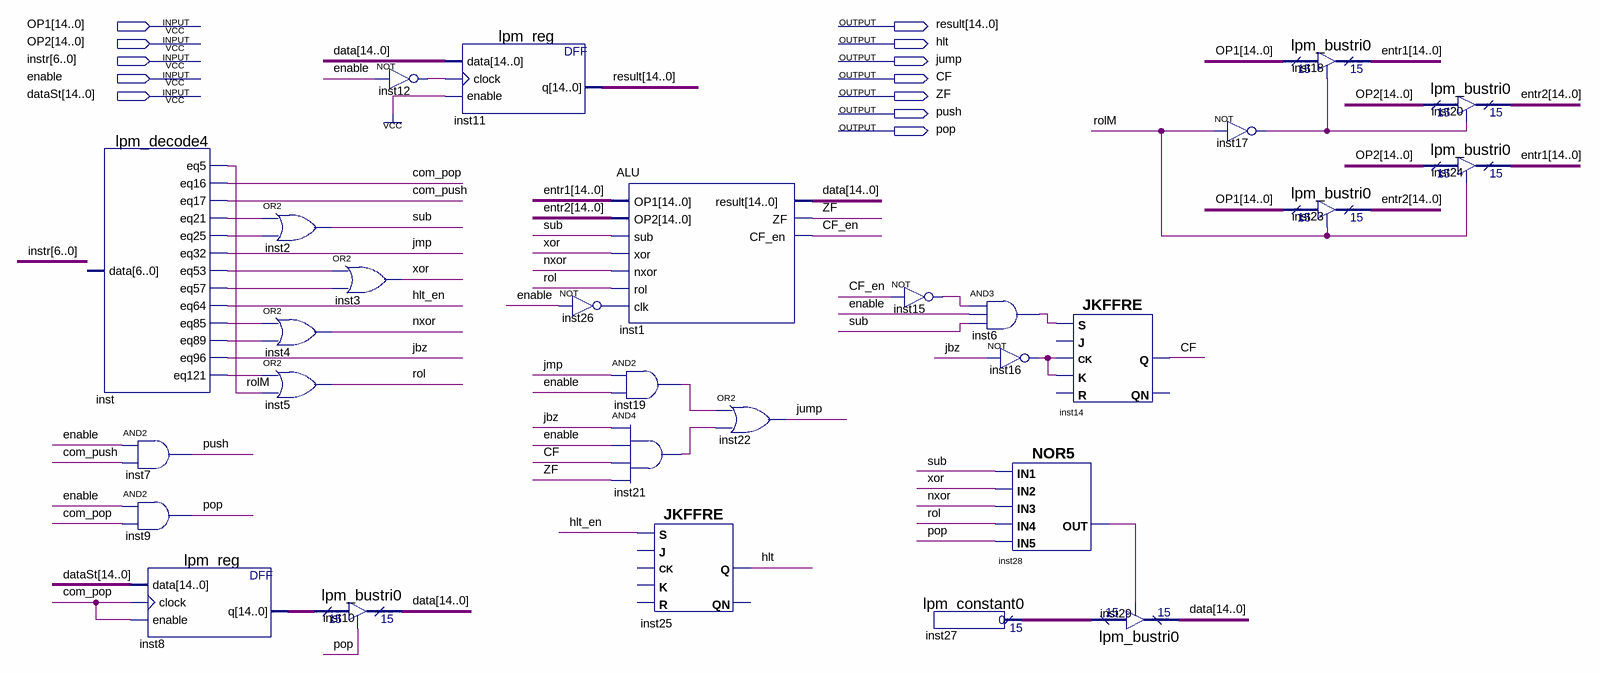
[diagram p0: schematic sheet]
// Quartus schematic execute.bdf as structural Verilog: 29 symbols, 12 pins
module execute (
  input  [14:0] OP1,
  input  [14:0] OP2,
  input  [6:0] instr,
  input  enable,
  input  [14:0] dataSt,
  output [14:0] result,
  output hlt,
  output jump,
  output CF,
  output ZF,
  output push,
  output pop
);

  wire CF_en, com_pop, com_push, hlt_en, inst6_out, inst12_out, inst15_out, inst16_out, inst17_out,
       inst19_out, inst21_out, inst26_out, inst28_out, inst_eq21, inst_eq25, inst_eq53, inst_eq57, inst_eq85,
       inst_eq89, inst_eq121, jbz, jmp, nxor, rol, rolM, sub, \xor ;
  wire [14:0] data, entr1, entr2, inst8_q, inst27_result;

  lpm_decode4 inst (
    .eq5(rolM), .eq16(com_pop), .eq17(com_push), .eq21(inst_eq21), .eq25(inst_eq25), .eq32(jmp),
    .eq53(inst_eq53), .eq57(inst_eq57), .eq64(hlt_en), .eq85(inst_eq85), .eq89(inst_eq89), .eq96(jbz),
    .eq121(inst_eq121));  // open: data
  and inst7 (push, enable, com_push);
  and inst9 (pop, enable, com_pop);
  lpm_reg inst8 (.data(dataSt), .clock(com_pop), .enable(com_pop), .q(inst8_q));
  or inst2 (sub, inst_eq21, inst_eq25);
  or inst4 (nxor, inst_eq85, inst_eq89);
  or inst5 (rol, inst_eq121, rolM);
  or inst3 (\xor , inst_eq53, inst_eq57);
  lpm_bustri0 inst10 (.enabledt(pop), .data(inst8_q), .tridata(data));
  not inst12 (inst12_out, enable);
  lpm_reg inst11 (.data(data), .clock(inst12_out), .enable(1'b1), .q(result));
  not inst26 (inst26_out, enable);
  ALU inst1 (
    .OP1(entr1), .OP2(entr2), .sub(sub), .\xor (\xor ), .nxor(nxor), .rol(rol), .clk(inst26_out),
    .result(data), .ZF(ZF), .CF_en(CF_en));
  and inst19 (inst19_out, jmp, enable);
  and inst21 (inst21_out, jbz, enable, CF, ZF);
  JKFFRE inst25 (.S(hlt_en), .Q(hlt));  // open: R, K, CK, J, QN
  or inst22 (jump, inst19_out, inst21_out);
  not inst15 (inst15_out, CF_en);
  and inst6 (inst6_out, inst15_out, enable, sub);
  lpm_constant0 inst27 (.result(inst27_result));
  not inst16 (inst16_out, jbz);
  nor inst28 (inst28_out, sub, \xor , nxor, rol, pop);
  JKFFRE inst14 (.K(inst16_out), .CK(inst16_out), .S(inst6_out), .Q(CF));  // open: R, J, QN
  lpm_bustri0 inst29 (.enabledt(inst28_out), .data(inst27_result), .tridata(data));
  not inst17 (inst17_out, rolM);
  lpm_bustri0 inst18 (.enabledt(inst17_out), .data(OP1), .tridata(entr1));
  lpm_bustri0 inst23 (.enabledt(rolM), .data(OP1), .tridata(entr2));
  lpm_bustri0 inst20 (.enabledt(inst17_out), .data(OP2), .tridata(entr2));
  lpm_bustri0 inst24 (.enabledt(rolM), .data(OP2), .tridata(entr1));
endmodule
